# EasyEDA Pro project backup.epro, board PCB_3
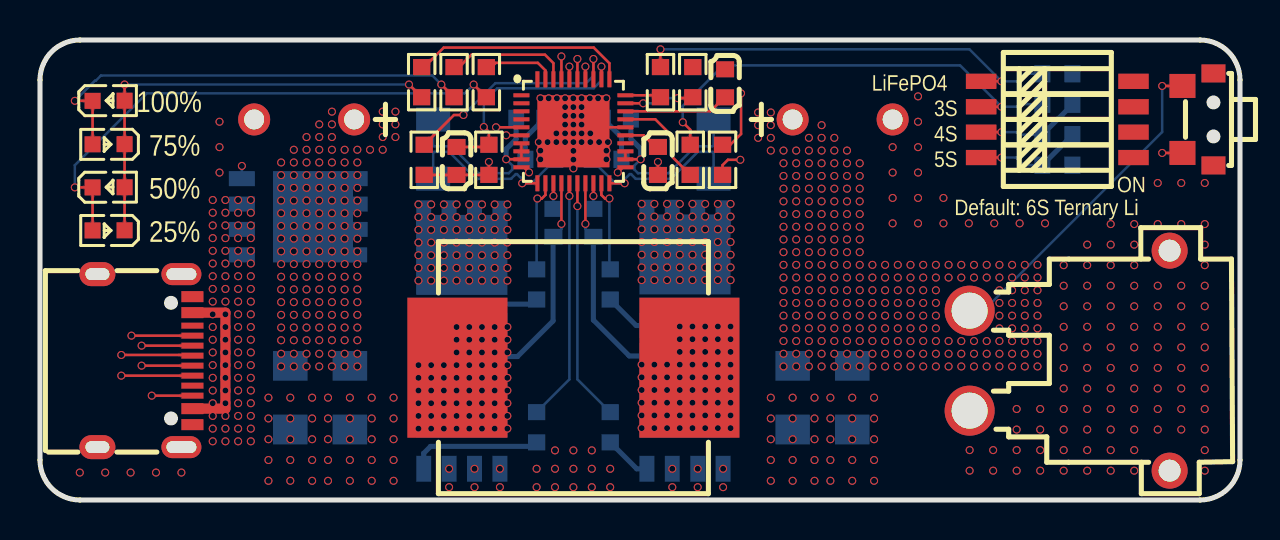
[diagram p12: board, top side]
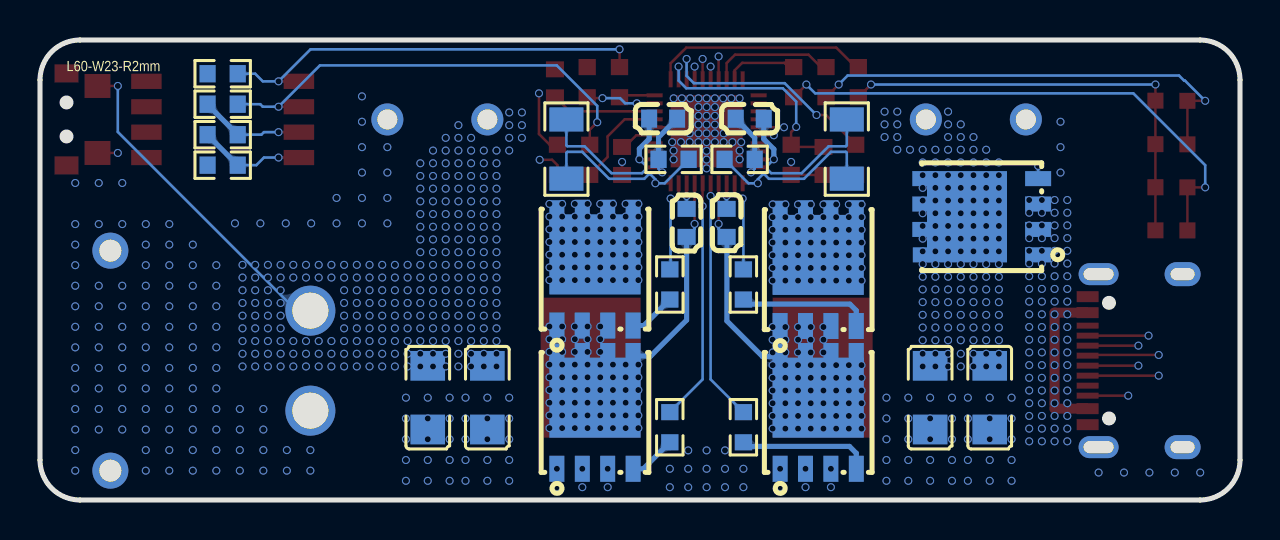
[diagram p13: board, bottom side, seen from below]

Outline 60 x 23 mm; copper layers: Top Layer, VCC & SIGNAL, GND, Bottom Layer. Coordinates in mm from the lower left corner of the outline.
Outline path: 0,21 0,2 arc(0.59,0.59) 2,0 58,0 arc(59.41,0.59) 60,2 60,21 arc(59.41,22.41) 58,23 2,23 arc(0.59,22.41) 0,21
Stack: Top Layer 0.035mm 外层铜厚1oz / Dielectric1 0.2104mm 7628 RC49% 8.6mil / VCC & SIGNAL 0.0152mm 内层铜厚 / Dielectric2 1.065mm 1.1mm H/HOZ 含铜 / GND 0.0152mm 内层铜厚 / Dielectric3 0.2104mm 7628 RC49% 8.6mil / Bottom Layer 0.035mm 外层铜厚1oz

## Design rules (mm)
template: 自定义配置
spacing copperThickness1oz: track to track 0.102, other pairs 0.152 to 0.3
spacing copperThickness2oz: track to track 0.203, other pairs 0.152 to 0.3
spacing 6mil (default): track to track 0.102, other pairs 0.127 to 0.127
track width copperThickness1oz (default): min 0.127, default 0.254, max 2.54
track width copperThickness2oz: min 0.203, default 0.254, max 2.54
track width 10mil: min 0.254, default 0.254, max 2.54
track width 20mil: min 0.508, default 0.508, max 2.54
differential pair differentialPair (default): width min 0.127, default 0.254, max 2.54; gap min 0.152, default 0.152
differential pair err=5mil: width min 0.127, default 0.254, max 2.54; gap min 0.152, default 0.254
via viaSize: diameter min 0.5, default 0.61, max 10; hole min 0.3, default 0.305, max 6.299
via 12-24: diameter min 0.5, default 0.61, max 10; hole min 0.3, default 0.305, max 6.299
via 6-12 (default): diameter min 0.305, default 0.305, max 10; hole min 0.152, default 0.152, max 6.299

## Placement (name value [footprint] x y rotation side)
C1  2.2uF  [C0603]  34.25 20.84 90 top
C2  2.2uF  [C0603]  30.9 16.95 270 top
C3  470nF  [C0603]  24.51 19.06 180 bottom
C4  1uF  [C0603]  28.84 19.07 0 bottom
C5  100nF  [C0603]  25.67 13.86 270 bottom
C6  100nF  [C0603]  27.67 13.86 90 bottom
C7  22uF  [C1206]  12.51 5.12 90 bottom
C8  22uF  [C1206]  15.49 5.12 90 bottom
C9  1000uF  [CAP-TH_BD10.0-P5.00-D0.6-FD-A]  13.21 19.03 180 top
C10  1000uF  [CAP-TH_BD10.0-P5.00-D0.6-FD-A]  40.13 19.03 0 top
C11  22uF  [C1206]  40.61 5.12 90 bottom
C12  22uF  [C1206]  37.63 5.12 90 bottom
C13  100nF  [C0603]  20.83 16.95 270 top
CN1  XT30PW-M  [CONN-TH_XT30PW-M]  51.48 6.97 90 top
L1  10uH  [IND-SMD_L12.6-W13.5]  26.67 6.62 0 top
LED1  NCD0603R1  [LED0603-RD_RED]  3.43 13.48 180 top
LED2  NCD0603R1  [LED0603-RD_RED]  3.43 15.64 0 top
LED3  NCD0603R1  [LED0603-RD_RED]  3.43 17.79 180 top
LED4  NCD0603R1  [LED0603-RD_RED]  3.43 19.96 0 top
Q1  BSC0702LS  [PG-TDSON-8_L5.0-W6.0-P1.27-BL-EP]  12.91 14.16 90 bottom
Q2  BSC0702LS  [PG-TDSON-8_L5.0-W6.0-P1.27-BL-EP]  21.09 11.52 180 bottom
Q3  BSC0702LS  [PG-TDSON-8_L5.0-W6.0-P1.27-BL-EP]  32.25 11.54 180 bottom
Q4  BSC0702LS  [PG-TDSON-8_L5.0-W6.0-P1.27-BL-EP]  21.09 4.38 180 bottom
Q5  BSC0702LS  [PG-TDSON-8_L5.0-W6.0-P1.27-BL-EP]  32.25 4.38 180 bottom
R1  1K  [R0603]  19.09 20.89 270 top
R2  1K  [R0603]  20.7 20.89 270 top
R3  1K  [R0603]  22.32 20.89 270 top
R4  27K  [R0603]  32.64 20.89 90 top
R5  6.2K  [R0603]  32.51 17.01 270 top
R6  3.6K  [R0603]  31.02 20.89 270 top
R7  51Ω  [R0603]  25.02 17.03 180 bottom
R8  10Ω  [R0603]  28.32 17.03 0 bottom
R9  2.9K  [R0603]  50.87 19.79 180 bottom
R10  5.5K  [R0603]  50.87 21.31 180 bottom
R11  5mΩ  [R1206]  19.66 17.55 270 bottom
R12  5mΩ  [R1206]  33.68 17.55 90 bottom
R13  NCP18XH103F03RB  [R0603]  22.44 17.01 270 top
R14  4.9K  [R0603]  50.87 18.27 180 bottom
R15  10Ω  [R0603]  24.83 10.78 90 bottom
R16  10Ω  [R0603]  28.51 10.78 270 bottom
R17  5K  [R0603]  50.87 16.74 180 bottom
R18  10Ω  [R0603]  24.83 3.64 90 bottom
R19  10Ω  [R0603]  28.51 3.64 270 bottom
R20  10K  [R0603]  19.21 17.01 90 top
R21  43K  [R0603]  34.13 17.01 270 top
SW1  DSHP04TSGET  [SW-SMD_8P-L6.7-W5.4-P1.27-LS8.4]  50.87 19.03 270 top
SW2  TS24CA  [SW-SMD_TS24CA]  57.9 19.03 270 top
U1  -  [IP2366]  24.17 15.94 0 top
USB1  TYPE-C 16PIN 2MD(073)  [USB-C-SMD_TYPE-C-6PIN-2MD-073]  5.25 6.97 270 top

## Footprints (pads in the part's own frame, mm; a bottom-side part is the same pattern mirrored in y, then rotated)
C0603
  rect 0.8x0.9 smd: 1(-0.7,0) 2(0.7,0)
C1206
  rect 1.485x1.728 smd: 1(-1.593,0) 2(1.593,0)
CAP-TH_BD10.0-P5.00-D0.6-FD-A
  round 1.6 hole 1: 1(-2.5,0) 2(2.5,0)
CONN-TH_XT30PW-M
  round 2.5 hole 1.8: 1(-2.5,5) 2(2.5,5)
  round 1.8 hole 1.1: 3(5.5,-5) 4(-5.5,-5)
IND-SMD_L12.6-W13.5
  rect 5x7 smd: 1(-5.8,0) 2(5.8,0)
IP2366
  rect 0.8x0.2 smd: 1(-0.1,4.3) 2(-0.1,3.9) 3(-0.1,3.5) 4(-0.1,3.1) 5(-0.1,2.7) 6(-0.1,2.3) 7(-0.1,1.9) 8(-0.1,1.5) 9(-0.1,1.1) 10(-0.1,0.7) 21(5.1,0.7) 22(5.1,1.1) 23(5.1,1.5) 24(5.1,1.9) 25(5.1,2.3) 26(5.1,2.7) 27(5.1,3.1) 28(5.1,3.5) 29(5.1,3.9) 30(5.1,4.3)
  rect 0.2x0.8 smd: 11(0.7,-0.1) 12(1.1,-0.1) 13(1.5,-0.1) 14(1.9,-0.1) 15(2.3,-0.1) 16(2.7,-0.1) 17(3.1,-0.1) 18(3.5,-0.1) 19(3.9,-0.1) 20(4.3,-0.1) 31(4.3,5.1) 32(3.9,5.1) 33(3.5,5.1) 34(3.1,5.1) 35(2.7,5.1) 36(2.3,5.1) 37(1.9,5.1) 38(1.5,5.1) 39(1.1,5.1) 40(0.7,5.1)
  rect 3.6x3.6 smd: 41(2.5,2.5)
LED0603-RD_RED
  rect 0.8x0.8 smd: 1(-0.799,-0.004) 2(0.799,0.004)
PG-TDSON-8_L5.0-W6.0-P1.27-BL-EP
  rect 0.75x1.3 smd: 1(-1.905,-2.82) 2(-0.635,-2.82) 3(0.635,-2.82) 4(1.905,-2.82) 5(1.905,2.82) 6(0.635,2.82) 7(-0.635,2.82) 8(-1.905,2.794)
  rect 4.56x4 smd: 8(0,0.737)
R0603
  rect 0.806x0.864 smd: 1(-0.753,0) 2(0.753,0)
R1206
  rect 1.208x1.701 smd: 1(-1.479,0) 2(1.479,0)
SW-SMD_8P-L6.7-W5.4-P1.27-LS8.4
  rect 0.762x1.524 smd: 1(-1.905,-3.81) 2(-0.635,-3.81) 3(0.635,-3.81) 4(1.905,-3.81) 5(1.905,3.81) 6(0.635,3.81) 7(-0.635,3.81) 8(-1.905,3.81)
SW-SMD_TS24CA
  rect 0.9x1.2 smd: 1(-2.3,0.775) 2(2.3,0.775)
  rect 1.2x1.3 smd: 3(-1.675,-0.775) 4(1.675,-0.775)
USB-C-SMD_TYPE-C-6PIN-2MD-073
  rect 0.55x1.1 smd: 1(-3.2,2.375) 2(-2.4,2.375) 11(2.4,2.375) 12(3.2,2.375)
  rect 0.3x1.1 smd: 3(-1.75,2.375) 4(-1.25,2.375) 5(-0.75,2.375) 6(-0.25,2.375) 7(0.25,2.375) 8(0.75,2.375) 9(1.25,2.375) 10(1.75,2.375)
  oval 1.1x2 hole 0.6x1.5: 13(-4.325,1.825) 14(4.325,1.825)
  oval 1.2x1.8 hole 0.6x1.2: 13(-4.325,-2.375) 14(4.325,-2.375)

## Nets
As in the schematic.

Pads without a net: U1 1 2 3 4 24 40; USB1 3 9

## Via types
v1: diameter 0.4, hole 0.3, Top Layer to Bottom Layer, 1002 vias

## Routing (per net, layer and track width the routed paths; a pad name or vN(x,y) marks a point on that pad's centre or on a via; arc(x,y) is an arc through that point)
GND: length 7.2
  Top Layer w0.127: C2.2 v1(30.9,16.9) ; U1.26 26.87,18.64 U1.41 ; R20.1 R13.2 v1(22.44,16.9)
  vias: v1(1.99,1.37) v1(3.26,1.37) v1(4.53,1.37) v1(5.8,1.37) v1(7.07,1.37) v1(8.97,18.91) v1(8.97,17.64) v1(8.97,16.37) v1(11.42,5.12) v1(11.42,4.08) v1(11.42,3.04) v1(11.42,2) v1(11.42,0.96) v1(12.51,5.12) v1(12.51,4.08) v1(12.51,3.04) v1(12.51,2) v1(12.51,0.96) v1(13.61,5.12) v1(13.61,4.08) v1(13.61,3.04) v1(13.61,2) v1(13.61,0.96) v1(14.4,5.12) v1(14.4,4.08) v1(14.4,3.04) v1(14.4,2) v1(14.4,0.96) v1(15.49,5.12) v1(15.49,4.08) v1(15.49,3.04) v1(15.49,2) v1(15.49,0.96) v1(16.59,5.12) v1(16.59,4.08) v1(16.59,3.04) v1(16.59,2) v1(16.59,0.96) v1(17.68,5.12) v1(17.68,4.08) v1(17.68,3.04) v1(17.68,2) v1(17.68,0.96) v1(20.46,1.56) v1(20.46,0.64) v1(21.72,1.56) v1(21.72,0.64) v1(23,1.56) v1(23,0.64) v1(24.83,1.56) v1(24.83,0.64) v1(24.94,17.9) v1(25.02,20.08) v1(25.02,17.47) v1(25.02,17.03) v1(25.43,20.08) v1(25.38,17.9) v1(25.84,20.08) v1(25.82,18.33) v1(25.82,17.9) v1(25.75,2.48) v1(25.75,1.56) v1(25.75,0.64) v1(26.25,20.08) v1(26.25,19.65) v1(26.25,19.21) v1(26.25,18.77) v1(26.25,18.33) v1(26.25,17.9) v1(26.67,20.08) v1(26.67,19.65) v1(26.67,19.21) v1(26.67,18.77) v1(26.67,18.33) v1(26.67,17.9) v1(26.67,17.46) v1(26.67,17.02) v1(26.67,16.58) v1(26.67,2.48) v1(26.67,1.56) v1(26.67,0.64) v1(27.08,20.08) v1(27.08,19.65) v1(27.08,19.21) v1(27.08,18.77) v1(27.08,18.33) v1(27.08,17.9) v1(27.49,20.08) v1(27.52,18.33) v1(27.52,17.9) v1(27.59,2.48) v1(27.59,1.56) v1(27.59,0.64) v1(27.9,20.08) v1(27.95,17.9) v1(28.32,20.08) v1(28.32,17.47) v1(28.32,17.03) v1(28.39,17.9) v1(28.51,1.56) v1(28.51,0.64) v1(31.62,1.56) v1(31.62,0.64) v1(32.88,1.56) v1(32.88,0.64) v1(34.16,1.56) v1(34.16,0.64) v1(36.54,5.12) v1(36.54,4.08) v1(36.54,3.04) v1(36.54,2) v1(36.54,0.96) v1(37.63,5.12) v1(37.63,4.08) v1(37.63,3.04) v1(37.63,2) v1(37.63,0.96) v1(38.72,5.12) v1(38.72,4.08) v1(38.72,3.04) v1(38.72,2) v1(38.72,0.96) v1(39.52,5.12) v1(39.52,4.08) v1(39.52,3.04) v1(39.52,2) v1(39.52,0.96) v1(40.61,5.12) v1(40.61,4.08) v1(40.61,3.04) v1(40.61,2) v1(40.61,0.96) v1(41.7,5.12) v1(41.7,4.08) v1(41.7,3.04) v1(41.7,2) v1(41.7,0.96) v1(42.63,17.64) v1(42.63,16.37) v1(42.63,15.1) v1(42.63,13.83) v1(43.9,20.18) v1(43.9,18.91) v1(43.9,17.64) v1(43.9,16.37) v1(43.9,15.1) v1(43.9,13.83) v1(45.17,15.1) v1(45.17,13.83) v1(46.44,13.83) v1(46.48,2.49) v1(46.48,1.47) v1(47.71,13.83) v1(47.66,2.49) v1(47.66,1.47) v1(48.83,4.55) v1(48.83,3.52) v1(48.83,2.49) v1(48.83,1.47) v1(48.98,13.83) v1(50.01,4.55) v1(50.01,3.52) v1(50.01,2.49) v1(50.01,1.47) v1(50.25,13.83) v1(51.18,11.74) v1(51.18,10.71) v1(51.18,9.69) v1(51.18,8.66) v1(51.18,7.63) v1(51.18,6.6) v1(51.18,5.58) v1(51.18,4.55) v1(51.18,3.52) v1(51.18,2.49) v1(51.18,1.47) v1(52.36,12.77) v1(52.36,11.74) v1(52.36,10.71) v1(52.36,9.69) v1(52.36,8.66) v1(52.36,7.63) v1(52.36,6.6) v1(52.36,5.58) v1(52.36,4.55) v1(52.36,3.52) v1(52.36,2.49) v1(52.36,1.47) v1(53.54,13.8) v1(53.54,12.77) v1(53.54,11.74) v1(53.54,10.71) v1(53.54,9.69) v1(53.54,8.66) v1(53.54,7.63) v1(53.54,6.6) v1(53.54,5.58) v1(53.54,4.55) v1(53.54,3.52) v1(53.54,2.49) v1(53.54,1.47) v1(54.71,13.8) v1(54.71,12.77) v1(54.71,11.74) v1(54.71,10.71) v1(54.71,9.69) v1(54.71,8.66) v1(54.71,7.63) v1(54.71,6.6) v1(54.71,5.58) v1(54.71,4.55) v1(54.71,3.52) v1(54.71,2.49) v1(54.71,1.47) v1(55.89,15.85) v1(55.89,13.8) v1(55.89,10.71) v1(55.89,9.69) v1(55.89,8.66) v1(55.89,7.63) v1(55.89,6.6) v1(55.89,5.58) v1(55.89,4.55) v1(55.89,3.52) v1(57.06,15.85) v1(57.06,13.8) v1(57.06,10.71) v1(57.06,9.69) v1(57.06,8.66) v1(57.06,7.63) v1(57.06,6.6) v1(57.06,5.58) v1(57.06,4.55) v1(57.06,3.52) v1(58.24,15.85) v1(58.24,13.8) v1(58.24,12.77) v1(58.24,11.74) v1(58.24,10.71) v1(58.24,9.69) v1(58.24,8.66) v1(58.24,7.63) v1(58.24,6.6) v1(58.24,5.58) v1(58.24,4.55) v1(58.24,3.52) v1(58.24,2.49) v1(58.24,1.47)
VBUS: length 25.7
  Top Layer w0.127: v1(22.8,18.64) U1.5
  Top Layer w0.508: USB1.2 9.27,9.37 v1(9.27,8.65) v1(9.27,8.01) v1(9.27,7.38) v1(9.27,6.74) v1(9.27,6.11) v1(9.27,5.47) v1(9.27,4.84) 9.27,4.57 USB1.11
  VCC & SIGNAL w0.127: 10.67,15 10.67,16.9 13.84,20.08 21.97,20.08 22.8,19.25 v1(22.8,18.64)
  vias: v1(8.64,15) v1(8.64,14.36) v1(8.64,13.73) v1(8.64,13.09) v1(8.64,12.46) v1(8.64,11.82) v1(8.64,11.19) v1(8.64,10.55) v1(8.64,9.92) v1(8.64,9.28) v1(8.64,8.65) v1(8.64,8.01) v1(8.64,7.38) v1(8.64,6.74) v1(8.64,6.11) v1(8.64,5.47) v1(8.64,4.84) v1(8.64,4.2) v1(8.64,3.57) v1(8.64,2.93) v1(9.27,15) v1(9.27,14.36) v1(9.27,13.73) v1(9.27,13.09) v1(9.27,12.46) v1(9.27,11.82) v1(9.27,11.19) v1(9.27,10.55) v1(9.27,9.92) v1(9.27,9.28) v1(9.27,4.2) v1(9.27,3.57) v1(9.27,2.93) v1(9.91,15) v1(9.91,14.36) v1(9.91,13.73) v1(9.91,13.09) v1(9.91,12.46) v1(9.91,11.82) v1(9.91,11.19) v1(9.91,10.55) v1(9.91,9.92) v1(9.91,9.28) v1(9.91,8.65) v1(9.91,8.01) v1(9.91,7.38) v1(9.91,6.74) v1(9.91,6.11) v1(9.91,5.47) v1(9.91,4.84) v1(9.91,4.2) v1(9.91,3.57) v1(9.91,2.93) v1(10.54,15) v1(10.54,14.36) v1(10.54,13.73) v1(10.54,13.09) v1(10.54,12.46) v1(10.54,11.82) v1(10.54,11.19) v1(10.54,10.55) v1(10.54,9.92) v1(10.54,9.28) v1(10.54,8.65) v1(10.54,8.01) v1(10.54,7.38) v1(10.54,6.74) v1(10.54,6.11) v1(10.54,5.47) v1(10.54,4.84) v1(10.54,4.2) v1(10.54,3.57) v1(10.54,2.93)
3S: length 22.8
  Top Layer w0.127: R5.1 32.51,18.51 v1(32.14,18.89) 32.13,18.88 ; SW1.2 v1(48.07,19.66)
  Bottom Layer w0.127: R9.2 48.99,19.79 48.86,19.66 v1(48.07,19.66) 46,21.73 34.16,21.73 32.14,19.7 v1(32.14,18.89)
4S: length 5.3
  Top Layer w0.127: SW1.3 v1(48.07,18.39)
  Bottom Layer w0.127: v1(48.07,18.39) 48.8,18.39 48.93,18.27 R14.2
  Bottom Layer w0.254: R9.1 51.62,19.77 R14.2
5S: length 5.4
  Top Layer w0.127: v1(48.07,17.12) SW1.4
  Bottom Layer w0.127: v1(48.07,17.12) 48.8,17.12 49.18,16.74 R17.2
  Bottom Layer w0.254: R17.2 51.62,18.25 R14.1
$C1_1: length 5.2
  Top Layer w0.127: 34.13,20.14 34.13,20.04 33.52,19.44 U1.28
$C2_1: length 1.7
  Top Layer w0.127: U1.25 30.19,18.24 30.77,17.65
$C3_1: length 3.6
  Top Layer w0.127: v1(24.45,16.38) 24.2,16.64 U1.10
  Bottom Layer w0.127: v1(24.45,16.38) 24.27,16.57 R7.2
  Bottom Layer w0.254: 25.21,19.06 24.27,18.12 R7.2
$C4_1: length 3.6
  Top Layer w0.127: v1(28.89,16.38) 29.14,16.64 U1.21
  Bottom Layer w0.127: R8.2 29.07,16.57 v1(28.89,16.38)
  Bottom Layer w0.254: R8.2 29.07,18.14 C4.1
$C5_1: length 1.3
  Top Layer w0.127: v1(25.67,15.2) U1.13
  Bottom Layer w0.127: C5.1 v1(25.67,15.2)
$C6_2: length 1.3
  Top Layer w0.127: U1.18 v1(27.67,15.2)
  Bottom Layer w0.127: C6.2 v1(27.67,15.2)
$LED1_1: length 22.4
  Top Layer w0.127: v1(4.23,20.78) LED4.2 LED3.1 LED2.2 LED1.1 ; v1(18.45,20.77) R1.2
  Bottom Layer w0.127: v1(18.45,20.77) 4.23,20.77
$LED1_2: length 26.7
  Top Layer w0.127: 1.74,15.63 LED2.1 LED1.2 ; v1(21.68,20.77) R3.2
  Bottom Layer w0.127: v1(1.74,15.63) 1.74,16.74 5.33,20.33 21.24,20.33 v1(21.68,20.77)
$LED3_2: length 23
  Top Layer w0.127: v1(20.07,20.77) R2.2 ; v1(1.74,19.96) LED4.1 LED3.2
  Bottom Layer w0.127: v1(20.07,20.77) 19.62,21.22 3.05,21.22 2.79,20.97 2.75,20.97 v1(1.74,19.96)
$Q1_4: length 17.5
  Top Layer w0.127: v1(23.31,18.24) U1.6
  VCC & SIGNAL w0.127: v1(23.31,18.24) 23.31,19.12 22.1,20.33 13.72,20.33 v1(10.09,16.7)
  Bottom Layer w0.127: Q1.4 v1(10.09,16.7)
$Q2_4: length 6.6
  Bottom Layer w0.254: Q2.4 19.19,9.48 19.5,9.79 24.6,9.79 R15.1
$Q2_5: length 9.6
  Top Layer w0.127: v1(24.11,15.84) U1.11
  Bottom Layer w0.127: R7.1 24.58,15.84 v1(24.11,15.84) 24.11,16.04 23.85,16.29 23.79,16.29 23.55,16.06 21.8,16.06 20.45,17.41 19.71,17.41 19.66,17.36 R11.2
  vias: v1(18.92,14.78) v1(18.92,14.14) v1(18.92,13.51) v1(18.92,12.87) v1(18.92,12.24) v1(18.92,11.6) v1(18.92,10.97) v1(19.56,14.78) v1(19.56,14.14) v1(19.56,13.51) v1(19.56,12.87) v1(19.56,12.24) v1(19.56,11.6) v1(19.56,10.97) v1(20.19,14.78) v1(20.19,14.14) v1(20.19,13.51) v1(20.19,12.87) v1(20.19,12.24) v1(20.19,11.6) v1(20.19,10.97) v1(20.83,14.78) v1(20.83,14.14) v1(20.83,13.51) v1(20.83,12.87) v1(20.83,12.24) v1(20.83,11.6) v1(20.83,10.97) v1(21.46,14.78) v1(21.46,14.14) v1(21.46,13.51) v1(21.46,12.87) v1(21.46,12.24) v1(21.46,11.6) v1(21.46,10.97) v1(22.1,14.78) v1(22.1,14.14) v1(22.1,13.51) v1(22.1,12.87) v1(22.1,12.24) v1(22.1,11.6) v1(22.1,10.97) v1(22.73,14.78) v1(22.73,14.14) v1(22.73,13.51) v1(22.73,12.87) v1(22.73,12.24) v1(22.73,11.6) v1(22.73,10.97) v1(23.37,14.78) v1(23.37,14.14) v1(23.37,13.51) v1(23.37,12.87) v1(23.37,12.24) v1(23.37,11.6) v1(23.37,10.97)
$Q3_4: length 2.4
  Bottom Layer w0.254: R16.2 29.81,8.72 30.34,8.72
$Q3_5: length 9.6
  Top Layer w0.127: U1.20 v1(29.23,15.84)
  Bottom Layer w0.127: R8.1 28.76,15.84 v1(29.23,15.84) 29.23,16.04 29.49,16.29 29.55,16.29 29.79,16.06 31.54,16.06 32.89,17.41 33.63,17.41 33.68,17.36 R12.1
  vias: v1(30.08,14.8) v1(30.08,14.17) v1(30.08,13.53) v1(30.08,12.9) v1(30.08,12.26) v1(30.08,11.63) v1(30.08,10.99) v1(30.72,14.8) v1(30.72,14.17) v1(30.72,13.53) v1(30.72,12.9) v1(30.72,12.26) v1(30.72,11.63) v1(30.72,10.99) v1(31.35,14.8) v1(31.35,14.17) v1(31.35,13.53) v1(31.35,12.9) v1(31.35,12.26) v1(31.35,11.63) v1(31.35,10.99) v1(31.99,14.8) v1(31.99,14.17) v1(31.99,13.53) v1(31.99,12.9) v1(31.99,12.26) v1(31.99,11.63) v1(31.99,10.99) v1(32.62,14.8) v1(32.62,14.17) v1(32.62,13.53) v1(32.62,12.9) v1(32.62,12.26) v1(32.62,11.63) v1(32.62,10.99) v1(33.26,14.8) v1(33.26,14.17) v1(33.26,13.53) v1(33.26,12.9) v1(33.26,12.26) v1(33.26,11.63) v1(33.26,10.99) v1(33.89,14.8) v1(33.89,14.17) v1(33.89,13.53) v1(33.89,12.9) v1(33.89,12.26) v1(33.89,11.63) v1(33.89,10.99) v1(34.53,14.8) v1(34.53,14.17) v1(34.53,13.53) v1(34.53,12.9) v1(34.53,12.26) v1(34.53,11.63) v1(34.53,10.99)
$Q4_4: length 6.6
  Bottom Layer w0.254: Q4.4 19.19,2.34 19.53,2.68 24.62,2.68 R18.1
$Q5_4: length 2.4
  Bottom Layer w0.254: Q5.4 29.83,1.56 R19.2
$R4_1: length 3.5
  Top Layer w0.127: v1(31.88,20.09) 32.56,20.09 32.6,20.14 R4.1 ; v1(30.16,19.84) U1.29
  Bottom Layer w0.127: v1(31.88,20.09) 31,20.09 30.75,19.84 v1(30.16,19.84)
$R21_1: length 29.4
  Top Layer w0.127: v1(35.05,20.33) 35.05,18.3 34.51,17.76 34,17.76 ; SW2.4 v1(56.11,17.35)
  VCC & SIGNAL w0.127: v1(56.11,17.35) 56.11,19.6 53.59,22.11 36.83,22.11 v1(35.05,20.33)
BAT_NUM: length 5
  Top Layer w0.127: R5.2 31.62,17.15 31.62,18.17 30.76,19.04 U1.27
BAT_P: length 26.6
  Top Layer w0.127: SW2.3 v1(56.11,20.7) ; U1.23 U1.22 v1(30.03,17.04)
  Bottom Layer w0.127: v1(56.11,20.7) 56.11,18.4 47.17,9.47 CN1.2 ; v1(30.03,17.04) 29.72,16.72 29.72,16.52 29.9,16.34 31.43,16.34 32.77,17.69 33.63,17.69 33.68,17.73 R12.2
  Bottom Layer w0.254: C4.2 29.54,18.05 30.03,17.56 v1(30.03,17.04)
  vias: v1(35.91,19.38) v1(35.91,18.74) v1(35.91,18.11) v1(36.54,19.38) v1(36.54,18.74) v1(36.54,18.11) v1(36.54,17.47) v1(37.18,17.47) v1(37.18,16.84) v1(37.18,16.2) v1(37.18,15.57) v1(37.18,14.93) v1(37.18,14.3) v1(37.18,13.66) v1(37.18,13.03) v1(37.18,12.39) v1(37.18,11.76) v1(37.18,11.12) v1(37.18,10.49) v1(37.18,9.85) v1(37.18,9.22) v1(37.18,8.58) v1(37.18,7.95) v1(37.18,7.31) v1(37.18,6.68) v1(37.81,17.47) v1(37.81,16.84) v1(37.81,16.2) v1(37.81,15.57) v1(37.81,14.93) v1(37.81,14.3) v1(37.81,13.66) v1(37.81,13.03) v1(37.81,12.39) v1(37.81,11.76) v1(37.81,11.12) v1(37.81,10.49) v1(37.81,9.85) v1(37.81,9.22) v1(37.81,8.58) v1(37.81,7.95) v1(37.81,7.31) v1(37.81,6.68) v1(38.44,18.11) v1(38.44,17.47) v1(38.44,16.84) v1(38.44,16.2) v1(38.44,15.57) v1(38.44,14.93) v1(38.44,14.3) v1(38.44,13.66) v1(38.44,13.03) v1(38.44,12.39) v1(38.44,11.76) v1(38.44,11.12) v1(38.44,10.49) v1(38.44,9.85) v1(38.44,9.22) v1(38.44,8.58) v1(38.44,7.95) v1(38.44,7.31) v1(38.44,6.68) v1(39.08,18.74) v1(39.08,18.11) v1(39.08,17.47) v1(39.08,16.84) v1(39.08,16.2) v1(39.08,15.57) v1(39.08,14.93) v1(39.08,14.3) v1(39.08,13.66) v1(39.08,13.03) v1(39.08,12.39) v1(39.08,11.76) v1(39.08,11.12) v1(39.08,10.49) v1(39.08,9.85) v1(39.08,9.22) v1(39.08,8.58) v1(39.08,7.95) v1(39.08,7.31) v1(39.08,6.68) v1(39.72,18.11) v1(39.72,17.47) v1(39.72,16.84) v1(39.72,16.2) v1(39.72,15.57) v1(39.72,14.93) v1(39.72,14.3) v1(39.72,13.66) v1(39.72,13.03) v1(39.72,12.39) v1(39.72,11.76) v1(39.72,11.12) v1(39.72,10.49) v1(39.72,9.85) v1(39.72,9.22) v1(39.72,8.58) v1(39.72,7.95) v1(39.72,7.31) v1(39.72,6.68) v1(40.35,17.47) v1(40.35,16.84) v1(40.35,16.2) v1(40.35,15.57) v1(40.35,14.93) v1(40.35,14.3) v1(40.35,13.66) v1(40.35,13.03) v1(40.35,12.39) v1(40.35,11.76) v1(40.35,11.12) v1(40.35,10.49) v1(40.35,9.85) v1(40.35,9.22) v1(40.35,8.58) v1(40.35,7.95) v1(40.35,7.31) v1(40.35,6.68) v1(40.99,16.84) v1(40.99,16.2) v1(40.99,15.57) v1(40.99,14.93) v1(40.99,14.3) v1(40.99,13.66) v1(40.99,13.03) v1(40.99,12.39) v1(40.99,11.76) v1(40.99,11.12) v1(40.99,10.49) v1(40.99,9.85) v1(40.99,9.22) v1(40.99,8.58) v1(40.99,7.95) v1(40.99,7.31) v1(40.99,6.68) v1(41.62,11.76) v1(41.62,11.12) v1(41.62,10.49) v1(41.62,9.85) v1(41.62,9.22) v1(41.62,8.58) v1(41.62,7.95) v1(41.62,7.31) v1(41.62,6.68) v1(42.25,11.76) v1(42.25,11.12) v1(42.25,10.49) v1(42.25,9.85) v1(42.25,9.22) v1(42.25,8.58) v1(42.25,7.95) v1(42.25,7.31) v1(42.25,6.68) v1(42.89,11.76) v1(42.89,11.12) v1(42.89,10.49) v1(42.89,9.85) v1(42.89,9.22) v1(42.89,8.58) v1(42.89,7.95) v1(42.89,7.31) v1(42.89,6.68) v1(43.53,11.76) v1(43.53,11.12) v1(43.53,10.49) v1(43.53,9.85) v1(43.53,9.22) v1(43.53,8.58) v1(43.53,7.95) v1(43.53,7.31) v1(43.53,6.68) v1(44.16,11.76) v1(44.16,11.12) v1(44.16,10.49) v1(44.16,9.85) v1(44.16,9.22) v1(44.16,8.58) v1(44.16,7.95) v1(44.16,7.31) v1(44.16,6.68) v1(44.79,11.76) v1(44.79,11.12) v1(44.79,10.49) v1(44.79,9.85) v1(44.79,9.22) v1(44.79,8.58) v1(44.79,7.95) v1(44.79,7.31) v1(44.79,6.68) v1(45.43,11.76) v1(45.43,11.12) v1(45.43,7.95) v1(45.43,7.31) v1(45.43,6.68) v1(46.06,11.76) v1(46.06,11.12) v1(46.06,7.95) v1(46.06,7.31) v1(46.06,6.68) v1(46.7,11.76) v1(46.7,11.12) v1(46.7,7.95) v1(46.7,7.31) v1(46.7,6.68) v1(47.34,11.76) v1(47.34,11.12) v1(47.34,7.95) v1(47.34,7.31) v1(47.34,6.68) v1(47.97,11.76) v1(47.97,11.12) v1(47.97,10.49) v1(47.97,9.85) v1(47.97,9.22) v1(47.97,8.58) v1(47.97,7.95) v1(47.97,7.31) v1(47.97,6.68) v1(48.6,11.76) v1(48.6,11.12) v1(48.6,10.49) v1(48.6,9.85) v1(48.6,9.22) v1(48.6,8.58) v1(48.6,7.95) v1(48.6,7.31) v1(48.6,6.68) v1(49.24,11.76) v1(49.24,11.12) v1(49.24,10.49) v1(49.24,9.85) v1(49.24,9.22) v1(49.24,8.58) v1(49.24,7.95) v1(49.24,7.31) v1(49.24,6.68) v1(49.88,11.76) v1(49.88,11.12) v1(49.88,10.49) v1(49.88,9.85) v1(49.88,9.22) v1(49.88,8.58) v1(49.88,7.95) v1(49.88,7.31) v1(49.88,6.68)
CC1: length 38
  Top Layer w0.127: v1(4.57,8.22) USB1.4 ; v1(26.07,22.18) U1.37
  VCC & SIGNAL w0.127: v1(26.07,22.18) 7.31,22.18 4.57,19.44 v1(4.57,8.22)
CC2: length 39.2
  Top Layer w0.127: v1(27.27,21.67) U1.34 ; v1(5.59,5.22) USB1.10
  VCC & SIGNAL w0.127: v1(5.59,5.22) 5.59,18.94 7.87,21.22 26.8,21.22 27.25,21.67 v1(27.27,21.67)
DM: length 40.6
  Top Layer w0.127: v1(5.08,6.72) USB1.7 ; v1(26.47,21.67) U1.36 ; v1(5.08,7.72) USB1.5
  VCC & SIGNAL w0.127: v1(5.08,6.72) v1(5.08,7.72) 5.08,19.19 7.56,21.67 v1(26.47,21.67)
DP: length 46
  Top Layer w0.127: v1(26.87,22.05) U1.35 ; v1(4.06,7.25) 7.59,7.25 USB1.6 ; v1(4.06,6.22) USB1.8
  VCC & SIGNAL w0.127: v1(4.06,6.22) 4.06,7 4.32,7.25 ; v1(26.87,22.05) 26.3,22.62 6.98,22.62 4.06,19.7 v1(4.06,7.25)
EN: length 23.1
  Top Layer w0.127: R20.2 20.7,19.25 v1(21.17,19.25) ; v1(27.67,22.05) U1.33 ; R21.2 34.13,16.74 34.4,17.01 v1(35.02,17.01)
  VCC & SIGNAL w0.127: v1(27.67,22.05) 27.67,21.36 32.03,17.01 v1(35.02,17.01)
  Bottom Layer w0.127: v1(27.67,22.05) 27.67,21.21 27.31,20.84 22.76,20.84 v1(21.17,19.25)
HG1: length 4.6
  Top Layer w0.127: v1(24.87,15.07) 25.09,15.07 25.27,15.25 25.27,15.83 U1.12
  Bottom Layer w0.127: R15.2 24.83,15.04 v1(24.87,15.07)
HG2: length 4.6
  Top Layer w0.127: v1(28.47,15.07) 28.25,15.07 28.07,15.25 28.07,15.83 U1.19
  Bottom Layer w0.127: v1(28.47,15.07) 28.47,11.57 R16.1
LED1: length 3.5
  Top Layer w0.127: 22.44,21.65 22.57,21.65 22.78,21.86 24.89,21.86 25.27,21.48 U1.39
LED2: length 6.1
  Top Layer w0.127: U1.38 25.67,21.84 25.25,22.27 21.57,22.27 20.96,21.65 20.83,21.65
LED3: length 10.8
  Top Layer w0.127: U1.31 28.47,21.84 27.69,22.62 20.19,22.62 19.21,21.65
LG1: length 12.1
  Top Layer w0.127: v1(26.47,15.2) U1.15
  Bottom Layer w0.127: R18.2 26.47,6.03 v1(26.47,15.2)
LG2: length 12.1
  Top Layer w0.127: v1(26.87,14.69) U1.16
  Bottom Layer w0.127: v1(26.87,14.69) 26.87,6.03 R19.1
NTC: length 11.6
  Top Layer w0.127: v1(22.19,18.65) 22.44,18.4 R13.1 22.33,17.65 C13.1 ; v1(28.07,21.67) U1.32
  Bottom Layer w0.127: v1(28.07,21.67) 28.07,21.67 28.07,20.97 27.69,20.59 22.86,20.59 22.19,19.92 v1(22.19,18.65)
SET: length 21.8
  Top Layer w0.127: SW1.1 v1(48.07,20.93) ; R6.1 v1(31.02,22.54)
  Bottom Layer w0.127: v1(31.02,22.54) 46.47,22.54 v1(48.07,20.93) 48.86,20.93 49.24,21.31 R10.2
SW1: length 10.5
  Top Layer w0.127: U1.14 v1(26.07,13.8)
  Bottom Layer w0.127: v1(26.07,13.8) 26.07,13.56 C5.2
  Bottom Layer w0.254: C5.2 25.65,13.14 25.65,8.95 23.88,7.17 Q4.8
  vias: v1(18.92,6.74) v1(18.92,6.11) v1(18.92,5.47) v1(18.92,4.84) v1(18.92,4.2) v1(18.92,3.57) v1(19.56,6.74) v1(19.56,6.11) v1(19.56,5.47) v1(19.56,4.84) v1(19.56,4.2) v1(19.56,3.57) v1(20.19,6.74) v1(20.19,6.11) v1(20.19,5.47) v1(20.19,4.84) v1(20.19,4.2) v1(20.19,3.57) v1(20.83,8.65) v1(20.83,8.01) v1(20.83,7.38) v1(20.83,6.74) v1(20.83,6.11) v1(20.83,5.47) v1(20.83,4.84) v1(20.83,4.2) v1(20.83,3.57) v1(21.46,8.65) v1(21.46,8.01) v1(21.46,7.38) v1(21.46,6.74) v1(21.46,6.11) v1(21.46,5.47) v1(21.46,4.84) v1(21.46,4.2) v1(21.46,3.57) v1(22.1,8.65) v1(22.1,8.01) v1(22.1,7.38) v1(22.1,6.74) v1(22.1,6.11) v1(22.1,5.47) v1(22.1,4.84) v1(22.1,4.2) v1(22.1,3.57) v1(22.73,8.65) v1(22.73,8.01) v1(22.73,7.38) v1(22.73,6.74) v1(22.73,6.11) v1(22.73,5.47) v1(22.73,4.84) v1(22.73,4.2) v1(22.73,3.57) v1(23.37,8.65) v1(23.37,8.01) v1(23.37,7.38) v1(23.37,6.74) v1(23.37,6.11) v1(23.37,5.47) v1(23.37,4.84) v1(23.37,4.2) v1(23.37,3.57)
SW2: length 10.4
  Top Layer w0.127: v1(27.27,13.8) U1.17
  Bottom Layer w0.127: v1(27.27,13.8) 27.27,13.56 C6.1
  Bottom Layer w0.254: C6.1 27.67,8.99 29.46,7.2 Q5.5
  vias: v1(30.08,6.77) v1(30.08,6.13) v1(30.08,5.5) v1(30.08,4.86) v1(30.08,4.23) v1(30.08,3.59) v1(30.72,6.77) v1(30.72,6.13) v1(30.72,5.5) v1(30.72,4.86) v1(30.72,4.23) v1(30.72,3.59) v1(31.35,6.77) v1(31.35,6.13) v1(31.35,5.5) v1(31.35,4.86) v1(31.35,4.23) v1(31.35,3.59) v1(31.99,8.67) v1(31.99,8.04) v1(31.99,7.4) v1(31.99,6.77) v1(31.99,6.13) v1(31.99,5.5) v1(31.99,4.86) v1(31.99,4.23) v1(31.99,3.59) v1(32.62,8.67) v1(32.62,8.04) v1(32.62,7.4) v1(32.62,6.77) v1(32.62,6.13) v1(32.62,5.5) v1(32.62,4.86) v1(32.62,4.23) v1(32.62,3.59) v1(33.26,8.67) v1(33.26,8.04) v1(33.26,7.4) v1(33.26,6.77) v1(33.26,6.13) v1(33.26,5.5) v1(33.26,4.86) v1(33.26,4.23) v1(33.26,3.59) v1(33.89,8.67) v1(33.89,8.04) v1(33.89,7.4) v1(33.89,6.77) v1(33.89,6.13) v1(33.89,5.5) v1(33.89,4.86) v1(33.89,4.23) v1(33.89,3.59) v1(34.53,8.67) v1(34.53,8.04) v1(34.53,7.4) v1(34.53,6.77) v1(34.53,6.13) v1(34.53,5.5) v1(34.53,4.86) v1(34.53,4.23) v1(34.53,3.59)
USER_P: length 10.3
  Top Layer w0.127: v1(23.31,17.04) U1.9 U1.8 U1.7
  Bottom Layer w0.127: R11.1 19.66,17.73 19.71,17.69 20.57,17.69 21.91,16.34 23.44,16.34 23.62,16.52 23.62,16.72 v1(23.31,17.04)
  Bottom Layer w0.254: C3.2 23.81,18.05 23.31,17.54 v1(23.31,17.04)
  vias: v1(12.06,16.88) v1(12.06,16.24) v1(12.06,15.61) v1(12.06,14.97) v1(12.06,14.34) v1(12.06,13.7) v1(12.06,13.07) v1(12.06,12.43) v1(12.06,11.8) v1(12.06,11.16) v1(12.06,10.53) v1(12.06,9.89) v1(12.06,9.26) v1(12.06,8.62) v1(12.06,7.99) v1(12.06,7.31) v1(12.06,6.68) v1(12.69,17.51) v1(12.69,16.88) v1(12.69,16.24) v1(12.69,15.61) v1(12.69,14.97) v1(12.69,14.34) v1(12.69,13.7) v1(12.69,13.07) v1(12.69,12.43) v1(12.69,11.8) v1(12.69,11.16) v1(12.69,10.53) v1(12.69,9.89) v1(12.69,9.26) v1(12.69,8.62) v1(12.69,7.99) v1(12.69,7.31) v1(12.69,6.68) v1(13.33,18.15) v1(13.33,17.51) v1(13.33,16.88) v1(13.33,16.24) v1(13.33,15.61) v1(13.33,14.97) v1(13.33,14.34) v1(13.33,13.7) v1(13.33,13.07) v1(13.33,12.43) v1(13.33,11.8) v1(13.33,11.16) v1(13.33,10.53) v1(13.33,9.89) v1(13.33,9.26) v1(13.33,8.62) v1(13.33,7.99) v1(13.33,7.31) v1(13.33,6.68) v1(13.96,18.78) v1(13.96,18.15) v1(13.96,17.51) v1(13.96,16.88) v1(13.96,16.24) v1(13.96,15.61) v1(13.96,14.97) v1(13.96,14.34) v1(13.96,13.7) v1(13.96,13.07) v1(13.96,12.43) v1(13.96,11.8) v1(13.96,11.16) v1(13.96,10.53) v1(13.96,9.89) v1(13.96,9.26) v1(13.96,8.62) v1(13.96,7.99) v1(13.96,7.31) v1(13.96,6.68) v1(14.6,19.42) v1(14.6,18.78) v1(14.6,18.15) v1(14.6,17.51) v1(14.6,16.88) v1(14.6,16.24) v1(14.6,15.61) v1(14.6,14.97) v1(14.6,14.34) v1(14.6,13.7) v1(14.6,13.07) v1(14.6,12.43) v1(14.6,11.8) v1(14.6,11.16) v1(14.6,10.53) v1(14.6,9.89) v1(14.6,9.26) v1(14.6,8.62) v1(14.6,7.99) v1(14.6,7.31) v1(14.6,6.68) v1(15.23,17.51) v1(15.23,16.88) v1(15.23,16.24) v1(15.23,15.61) v1(15.23,14.97) v1(15.23,14.34) v1(15.23,13.7) v1(15.23,13.07) v1(15.23,12.43) v1(15.23,11.8) v1(15.23,11.16) v1(15.23,10.53) v1(15.23,9.89) v1(15.23,9.26) v1(15.23,8.62) v1(15.23,7.99) v1(15.23,7.31) v1(15.23,6.68) v1(15.87,17.51) v1(15.87,16.88) v1(15.87,16.24) v1(15.87,15.61) v1(15.87,14.97) v1(15.87,14.34) v1(15.87,13.7) v1(15.87,13.07) v1(15.87,12.43) v1(15.87,11.8) v1(15.87,11.16) v1(15.87,10.53) v1(15.87,9.89) v1(15.87,9.26) v1(15.87,8.62) v1(15.87,7.99) v1(15.87,7.31) v1(15.87,6.68) v1(16.5,17.51) v1(17.14,19.42) v1(17.14,18.78) v1(17.14,18.15) v1(17.14,17.51) v1(17.77,19.42) v1(17.77,18.78) v1(17.77,18.15)
VSET: length 1.7
  Top Layer w0.127: U1.30 30.83,20.24 30.91,20.16 30.9,20.14

## Copper pours and planes (outline as drawn; the poured copper is in the pictures)
GND on Top Layer: -4.57,26.94 62.74,26.94 62.74,-3.8 -4.57,-3.8
GND on Bottom Layer: -5.59,28.72 64.77,28.72 64.77,-4.81 -5.59,-4.81
GND on GND: 0.26,22.74 59.74,22.74 59.74,0.26 0.26,0.26
VBUS on Top Layer: 10.79,15.25 10.79,2.55 8.38,2.55 8.38,15.25
VBUS on Bottom Layer: 10.79,15.25 10.79,2.55 8.38,2.55 8.38,15.25
VBUS on VCC & SIGNAL: 10.79,15.25 10.79,2.55 8.38,2.55 8.38,15.25
$Q2_5 on Top Layer: 18.4,15.24 23.78,15.24 23.78,10.37 18.4,10.37
$Q2_5 on Bottom Layer: 18.41,16.6 18.41,10.17 23.78,10.17 23.78,15.24 20.74,15.24 20.74,16.6
$Q2_5 on VCC & SIGNAL: 18.41,16.6 18.41,10.17 23.78,10.17 23.78,15.24 20.74,15.24 20.74,16.6
$Q3_5 on Top Layer: 29.56,15.26 34.94,15.26 34.94,10.39 29.56,10.39
$Q3_5 on Bottom Layer: 34.94,16.6 32.6,16.6 32.6,15.24 29.56,15.24 29.56,10.17 34.94,10.17
$Q3_5 on VCC & SIGNAL: 34.94,16.6 32.6,16.6 32.6,15.24 29.56,15.24 29.56,10.17 34.94,10.17
BAT_P on Top Layer: 36.54,12.05 50.47,12.05 50.47,6.04 36.54,6.04
BAT_P on Top Layer: 35.13,18.27 36.54,16.86 36.54,6.04 41.7,6.04 41.7,16.86 38.7,19.86 35.13,19.86
BAT_P on Bottom Layer: 36.54,12.05 50.47,12.05 50.47,6.04 36.54,6.04
BAT_P on Bottom Layer: 32.6,19.86 32.6,18.5 34.89,18.5 36.54,16.86 36.54,6.04 41.7,6.04 41.7,16.86 38.7,19.86
BAT_P on VCC & SIGNAL: 32.6,19.86 32.6,18.5 34.89,18.5 36.54,16.86 36.54,6.04 41.7,6.04 41.7,16.86 38.7,19.86
BAT_P on VCC & SIGNAL: 36.54,12.05 50.47,12.05 50.47,6.04 36.54,6.04
SW1 on Top Layer: 23.78,9.35 23.78,3.06 18.4,3.06 18.4,9.35
SW1 on Bottom Layer: 23.78,9.35 23.78,3.06 18.4,3.06 18.4,9.35
SW1 on Bottom Layer: 34.94,9.37 34.94,3.09 29.56,3.09 29.56,9.37
SW1 on VCC & SIGNAL: 23.78,9.35 23.78,3.06 18.4,3.06 18.4,9.35
SW1 on VCC & SIGNAL: 34.94,9.37 34.94,3.09 29.56,3.09 29.56,9.37
SW2 on Top Layer: 34.93,9.37 34.93,3.06 29.56,3.06 29.56,9.37
SW2 on Bottom Layer: 34.93,9.37 34.93,3.06 29.56,3.06 29.56,9.37
SW2 on VCC & SIGNAL: 34.93,9.37 34.93,3.06 29.56,3.06 29.56,9.37
USER_P on Top Layer: 11.42,6.04 16.59,6.04 16.59,16.47 18.2,18.09 18.2,19.86 14.42,19.86 11.42,16.86
USER_P on Bottom Layer: 20.74,19.86 20.74,18.5 18.58,18.5 17.4,17.32 17.4,17.29 16.59,16.47 16.59,6.04 11.42,6.04 11.42,16.86 14.42,19.86
USER_P on VCC & SIGNAL: 20.74,19.86 20.74,18.5 18.58,18.5 17.4,17.32 17.4,17.29 16.59,16.47 16.59,6.04 11.42,6.04 11.42,16.86 14.42,19.86

Small or netless copper shapes (teardrops, artwork), in the pictures only: 143 on Top Layer, 89 on Bottom Layer, 23 on VCC & SIGNAL

## Text on the board
Bottom Silkscreen Layer: L60-W23-R2mm
Document Layer: 稳定版本不做修改
Top Silkscreen Layer: LiFePO4 | 3S | 4S | 5S | Default: 6S Ternary Li | ON | 100% | 75% | 50% | 25%
